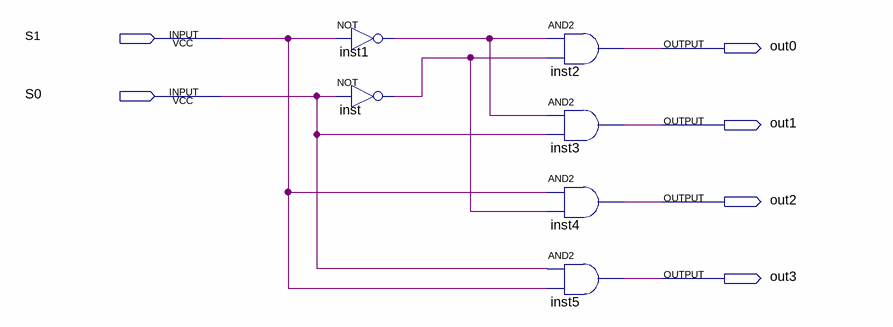
[diagram p0: schematic sheet]
// Quartus schematic decoder2bit.bdf as structural Verilog: 6 symbols, 6 pins
module decoder2bit (
  input  S1,
  input  S0,
  output out0,
  output out1,
  output out2,
  output out3
);

  wire inst1_out, inst_out;

  not inst1 (inst1_out, S1);
  not inst (inst_out, S0);
  and inst2 (out0, inst1_out, inst_out);
  and inst3 (out1, inst1_out, S0);
  and inst4 (out2, S1, inst_out);
  and inst5 (out3, S0, S1);
endmodule
